# Altium schematic sheet Memory.SchDoc
size A3
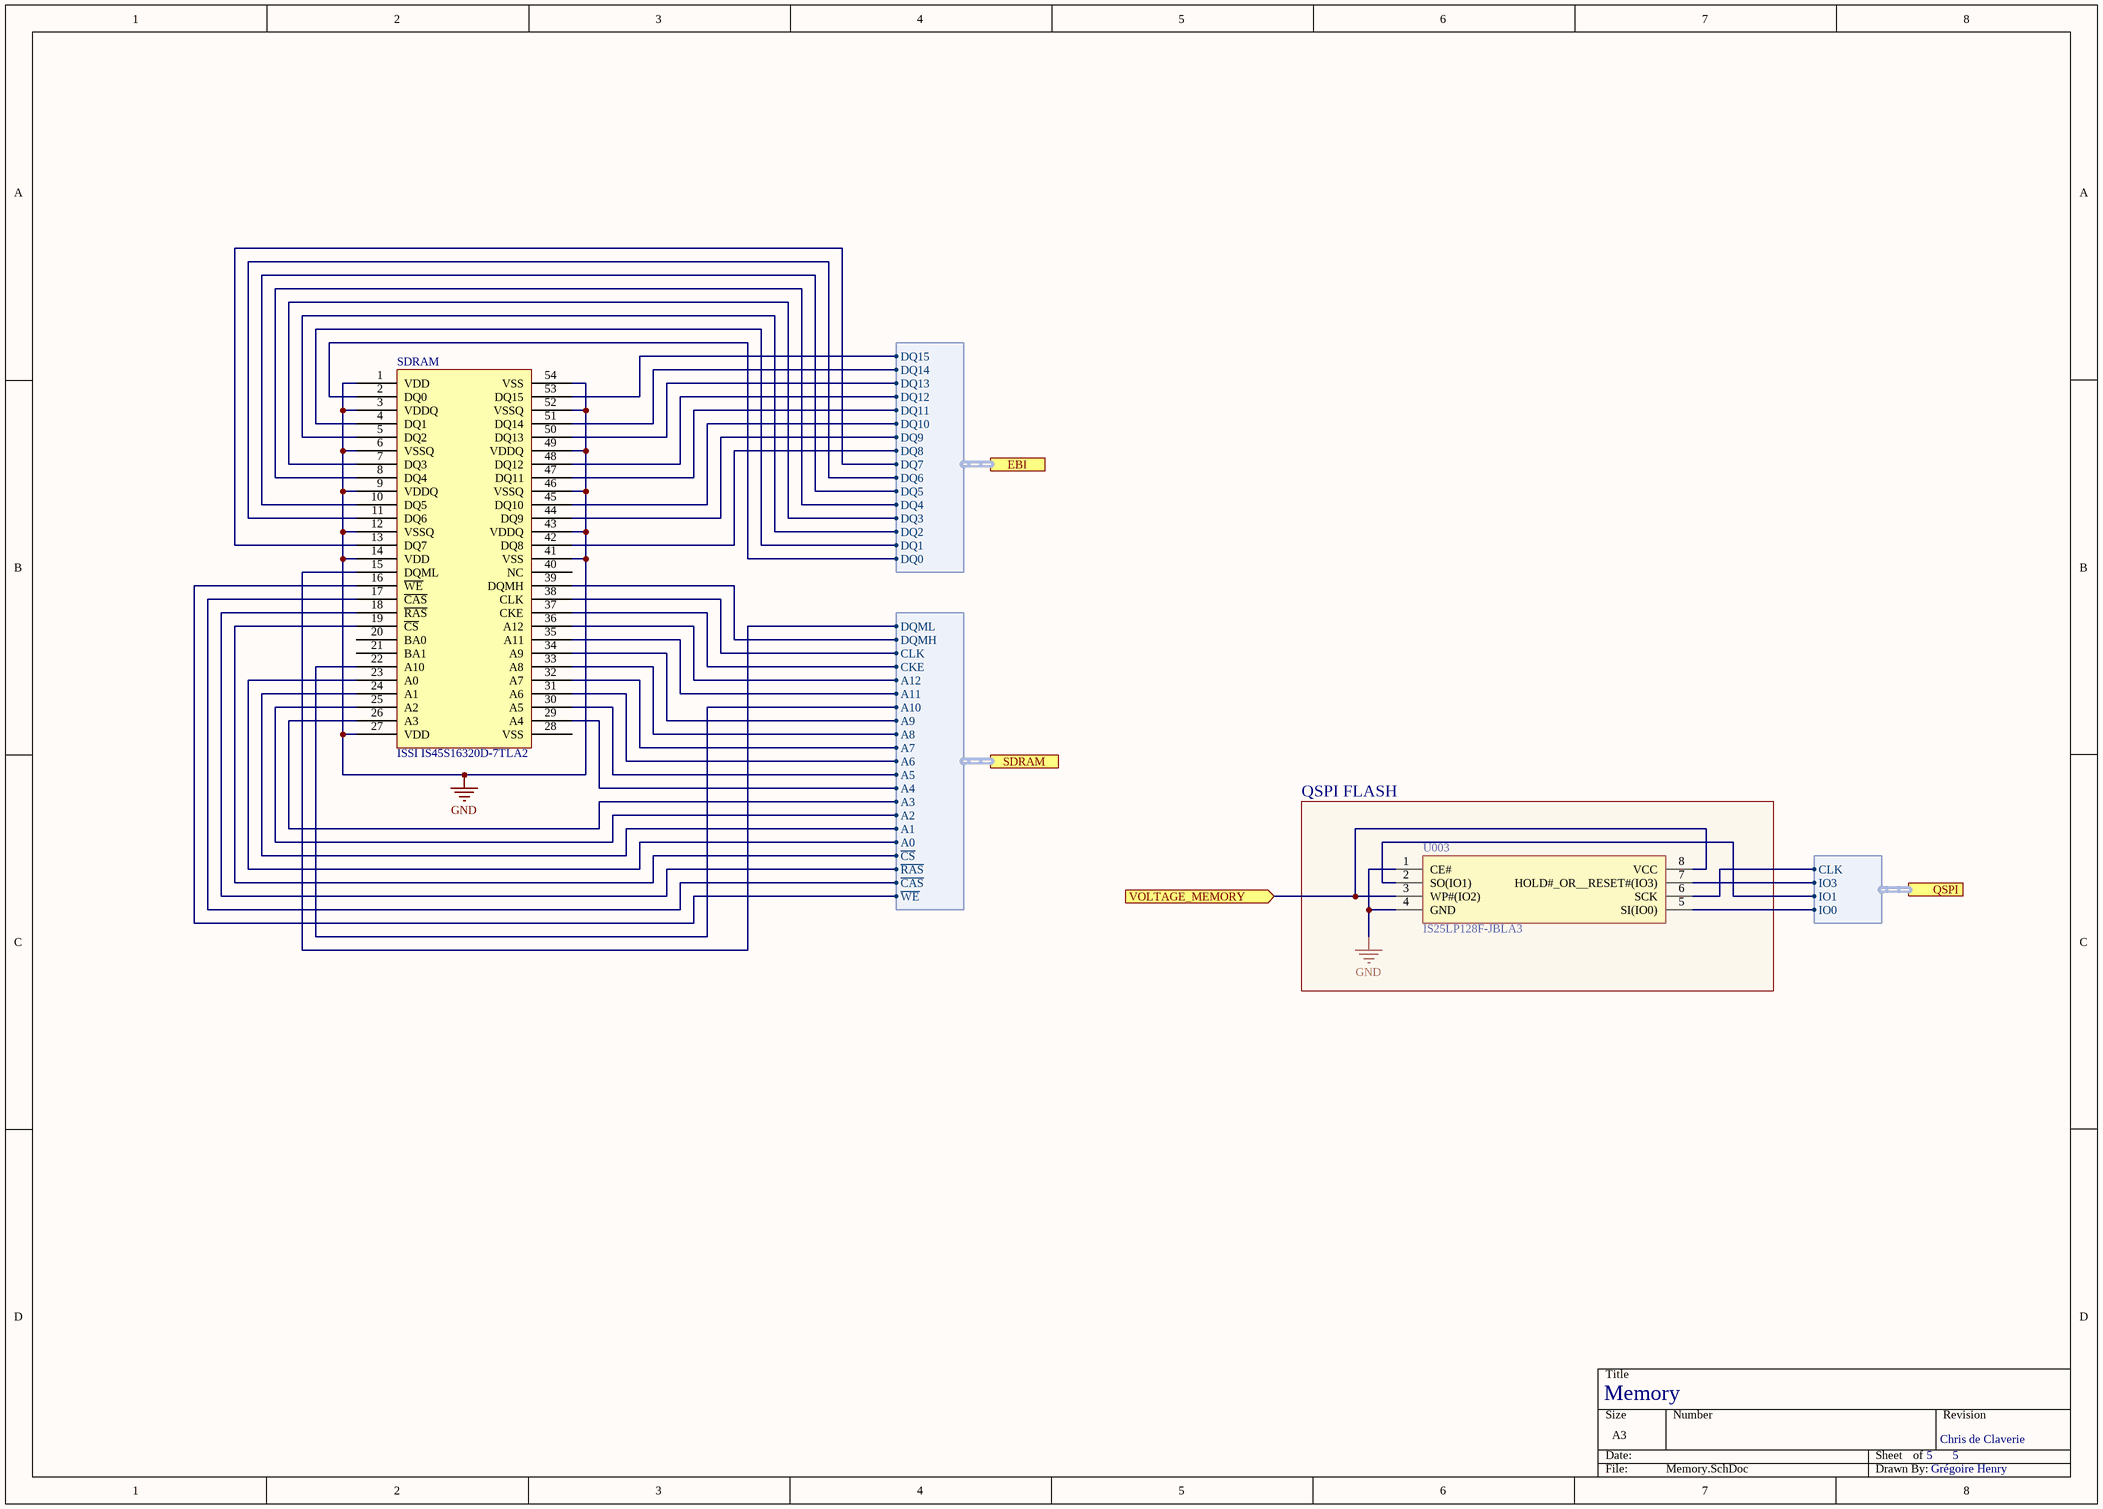
[diagram p0: Memory.SchDoc]

## Parts
SDRAM  ISSI IS45S16320D-7TLA2  [ISSI IS45S16320D-7TLA2]
U003  IS25LP128F-JBLA3  [SOIC127P790X216-8N]

## Blocks framed on the sheet
QSPI FLASH: U003

## Ports
EBI (harness *), QSPI (harness *), SDRAM (harness *), VOLTAGE_MEMORY (in)

## Harnesses
*: IO1, IO3, CLK, IO0
*: A2, A1, A0, A3, A4, A5, A6, A8, A7, A9, A10, A11, CLK, CKE, ~{CS}, ~{RAS}, ~{CAS}, ~{WE}, DQML, DQMH, A12
*: DQ1, DQ0, DQ2, DQ3, DQ4, DQ5, DQ7, DQ6, DQ8, DQ9, DQ10, DQ13, DQ12, DQ15, DQ14, DQ11

## Nets
GND: SDRAM.1(VDD) SDRAM.3(VDDQ) SDRAM.6(VSSQ) SDRAM.9(VDDQ) SDRAM.12(VSSQ) SDRAM.14(VDD) SDRAM.27(VDD) SDRAM.41(VSS) SDRAM.43(VDDQ) SDRAM.46(VSSQ) SDRAM.49(VDDQ) SDRAM.52(VSSQ) SDRAM.54(VSS) U003.1(CE#) U003.4(GND)
VOLTAGE_MEMORY: U003.3(WP#(IO2)) U003.8(VCC) ; port VOLTAGE_MEMORY
NetSDRAM_2: SDRAM.2(DQ0) ; port EBI.DQ0
NetSDRAM_4: SDRAM.4(DQ1) ; port EBI.DQ1
NetSDRAM_5: SDRAM.5(DQ2) ; port EBI.DQ2
NetSDRAM_7: SDRAM.7(DQ3) ; port EBI.DQ3
NetSDRAM_8: SDRAM.8(DQ4) ; port EBI.DQ4
NetSDRAM_10: SDRAM.10(DQ5) ; port EBI.DQ5
NetSDRAM_11: SDRAM.11(DQ6) ; port EBI.DQ6
NetSDRAM_13: SDRAM.13(DQ7) ; port EBI.DQ7
NetSDRAM_15: SDRAM.15(DQML) ; port SDRAM.DQML
NetSDRAM_16: SDRAM.16(~{WE}) ; port SDRAM.~{WE}
NetSDRAM_17: SDRAM.17(~{CAS}) ; port SDRAM.~{CAS}
NetSDRAM_18: SDRAM.18(~{RAS}) ; port SDRAM.~{RAS}
NetSDRAM_19: SDRAM.19(~{CS}) ; port SDRAM.~{CS}
NetSDRAM_22: SDRAM.22(A10) ; port SDRAM.A10
NetSDRAM_23: SDRAM.23(A0) ; port SDRAM.A0
NetSDRAM_24: SDRAM.24(A1) ; port SDRAM.A1
NetSDRAM_25: SDRAM.25(A2) ; port SDRAM.A2
NetSDRAM_26: SDRAM.26(A3) ; port SDRAM.A3
NetSDRAM_29: SDRAM.29(A4) ; port SDRAM.A4
NetSDRAM_30: SDRAM.30(A5) ; port SDRAM.A5
NetSDRAM_31: SDRAM.31(A6) ; port SDRAM.A6
NetSDRAM_32: SDRAM.32(A7) ; port SDRAM.A7
NetSDRAM_33: SDRAM.33(A8) ; port SDRAM.A8
NetSDRAM_34: SDRAM.34(A9) ; port SDRAM.A9
NetSDRAM_35: SDRAM.35(A11) ; port SDRAM.A11
NetSDRAM_36: SDRAM.36(A12) ; port SDRAM.A12
NetSDRAM_37: SDRAM.37(CKE) ; port SDRAM.CKE
NetSDRAM_38: SDRAM.38(CLK) ; port SDRAM.CLK
NetSDRAM_39: SDRAM.39(DQMH) ; port SDRAM.DQMH
NetSDRAM_42: SDRAM.42(DQ8) ; port EBI.DQ8
NetSDRAM_44: SDRAM.44(DQ9) ; port EBI.DQ9
NetSDRAM_45: SDRAM.45(DQ10) ; port EBI.DQ10
NetSDRAM_47: SDRAM.47(DQ11) ; port EBI.DQ11
NetSDRAM_48: SDRAM.48(DQ12) ; port EBI.DQ12
NetSDRAM_50: SDRAM.50(DQ13) ; port EBI.DQ13
NetSDRAM_51: SDRAM.51(DQ14) ; port EBI.DQ14
NetSDRAM_53: SDRAM.53(DQ15) ; port EBI.DQ15
NetU003_2: U003.2(SO(IO1)) ; port QSPI.IO1
NetU003_5: U003.5(SI(IO0)) ; port QSPI.IO0
NetU003_6: U003.6(SCK) ; port QSPI.CLK
NetU003_7: U003.7(HOLD#_OR__RESET#(IO3)) ; port QSPI.IO3

Not connected (* = marked no-connect by the designer): SDRAM 20(BA0) 21(BA1) 28(VSS) 40(NC)

## Notes on the sheet
- Memory
- 5
- Chris de Claverie
- Grégoire Henry

## Library data of the parts
U003 = IS25LP128F-JBLA3: Integrated Circuit; Manufacturer_Name: Integrated Silicon Solution Inc.; Datasheet Link: https://componentsearchengine.com/Datasheets/1/IS25LP128F-JBLA3.pdf; Height: 2.16mm; Mouser Part Number: 870-IS25LP128F-JBLA3; Mouser Price/Stock: https://www.mouser.com/Search/Refine.aspx?Keyword=870-IS25LP128F-JBLA3; Manufacturer_Part_Number: IS25LP128F-JBLA3